# Altium schematic sheet RF_SMA_WBC1-1.SchDoc
size A3
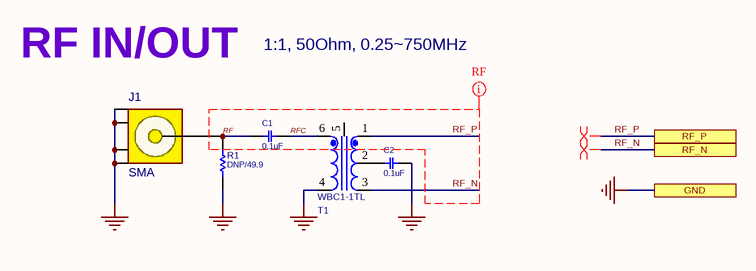
[diagram p0: RF_SMA_WBC1-1.SchDoc]

## Parts
C1  0.1uF  [C0402]
C2  0.1uF  [C0402]
J1  SMA  [SMA_ST]
R1  DNP/49.9  [R0402]
T1  WBC1-1TL  [TRNS150_6_450X420]

## Ports
GND, RF_N, RF_P

## Nets
GND: C2.2 J1.2(G1) J1.3(G2) J1.4(G3) J1.5(G4) R1.1 T1.4(SEC) ; port GND
RF: C1.1 J1.1(SIG) R1.2
RF_N: T1.3(PRI) ; port RF_N
RF_P: T1.1(PRIDOT) ; port RF_P
RFC: C1.2 T1.6(SECDOT)
NetC2_1: C2.1 T1.2(PRICT)

Not connected (* = marked no-connect by the designer): T1 5(NC)

## Layout directives
net class RF: RF, RF_N, RF_P, RFC
differential pair: RF_N, RF_P

## Notes on the sheet
- (near J1) RF IN/OUT
- 1:1, 50Ohm, 0.25~750MHz
- Title
- Size:
- Date:
- A3
- Number:
- Time:
- Revision:
- Sheet
- of
- File:

## Library data of the parts
C1 C2 = CAP_SMD_MLCC_100n50T: CAP, MLCC; PARAM: X5R, 10%; MANF_P#: GRM155R61E104; MANF: Murata; PARAM2: 25v; ASSEMBLY: ASSEMBLY; PRICE: 10,000:$0.006; VALUE: 0.1uF
J1 = CONN_RF_SMA_ST: CONN, RF, SMA, STRAIGHT; MANF_P#: 142-0701-201; MANF: Johnson; PARAM: 50Ohm, 18GHz; DESC: DESCRIPTION; DIST#: MOUSER; PARAM2: GOLD; ASSEMBLY: ASSEMBLY; PRICE: 2.7$; VALUE: SMA
R1 = RES_SMD_10K_0402: RESISTOR, SMD; PARAM: 0.063W; DESC: DESCRIPTION; DIST#: MOUSER; PARAM2: 1%; MANF: -; ASSEMBLY: ASSEMBLY; PRICE: 100= 0.3$; VALUE: DNP/49.9; MANF_P#: -
T1 = WBC1-1TL: RF Transformer, 1:1, 50Ohm, 0.25~750MHz; MANF: Coilcraft; PARAM2: 36mA; MANF_P#: WBC1-1TL; PARAM: 1:1, 50Ohm, 0.25~750MHz; PRICE: 5$; VALUE: WBC1-1TL